# EasyEDA schematic microbit-v2-smart-robot-schematic-diagram.json
TITLE: microbit-v2-smart-robot; REV: 1.0; Date: 2023-03-23; Sheet: 1/1; Drawn By: professor_zia; Company: CET
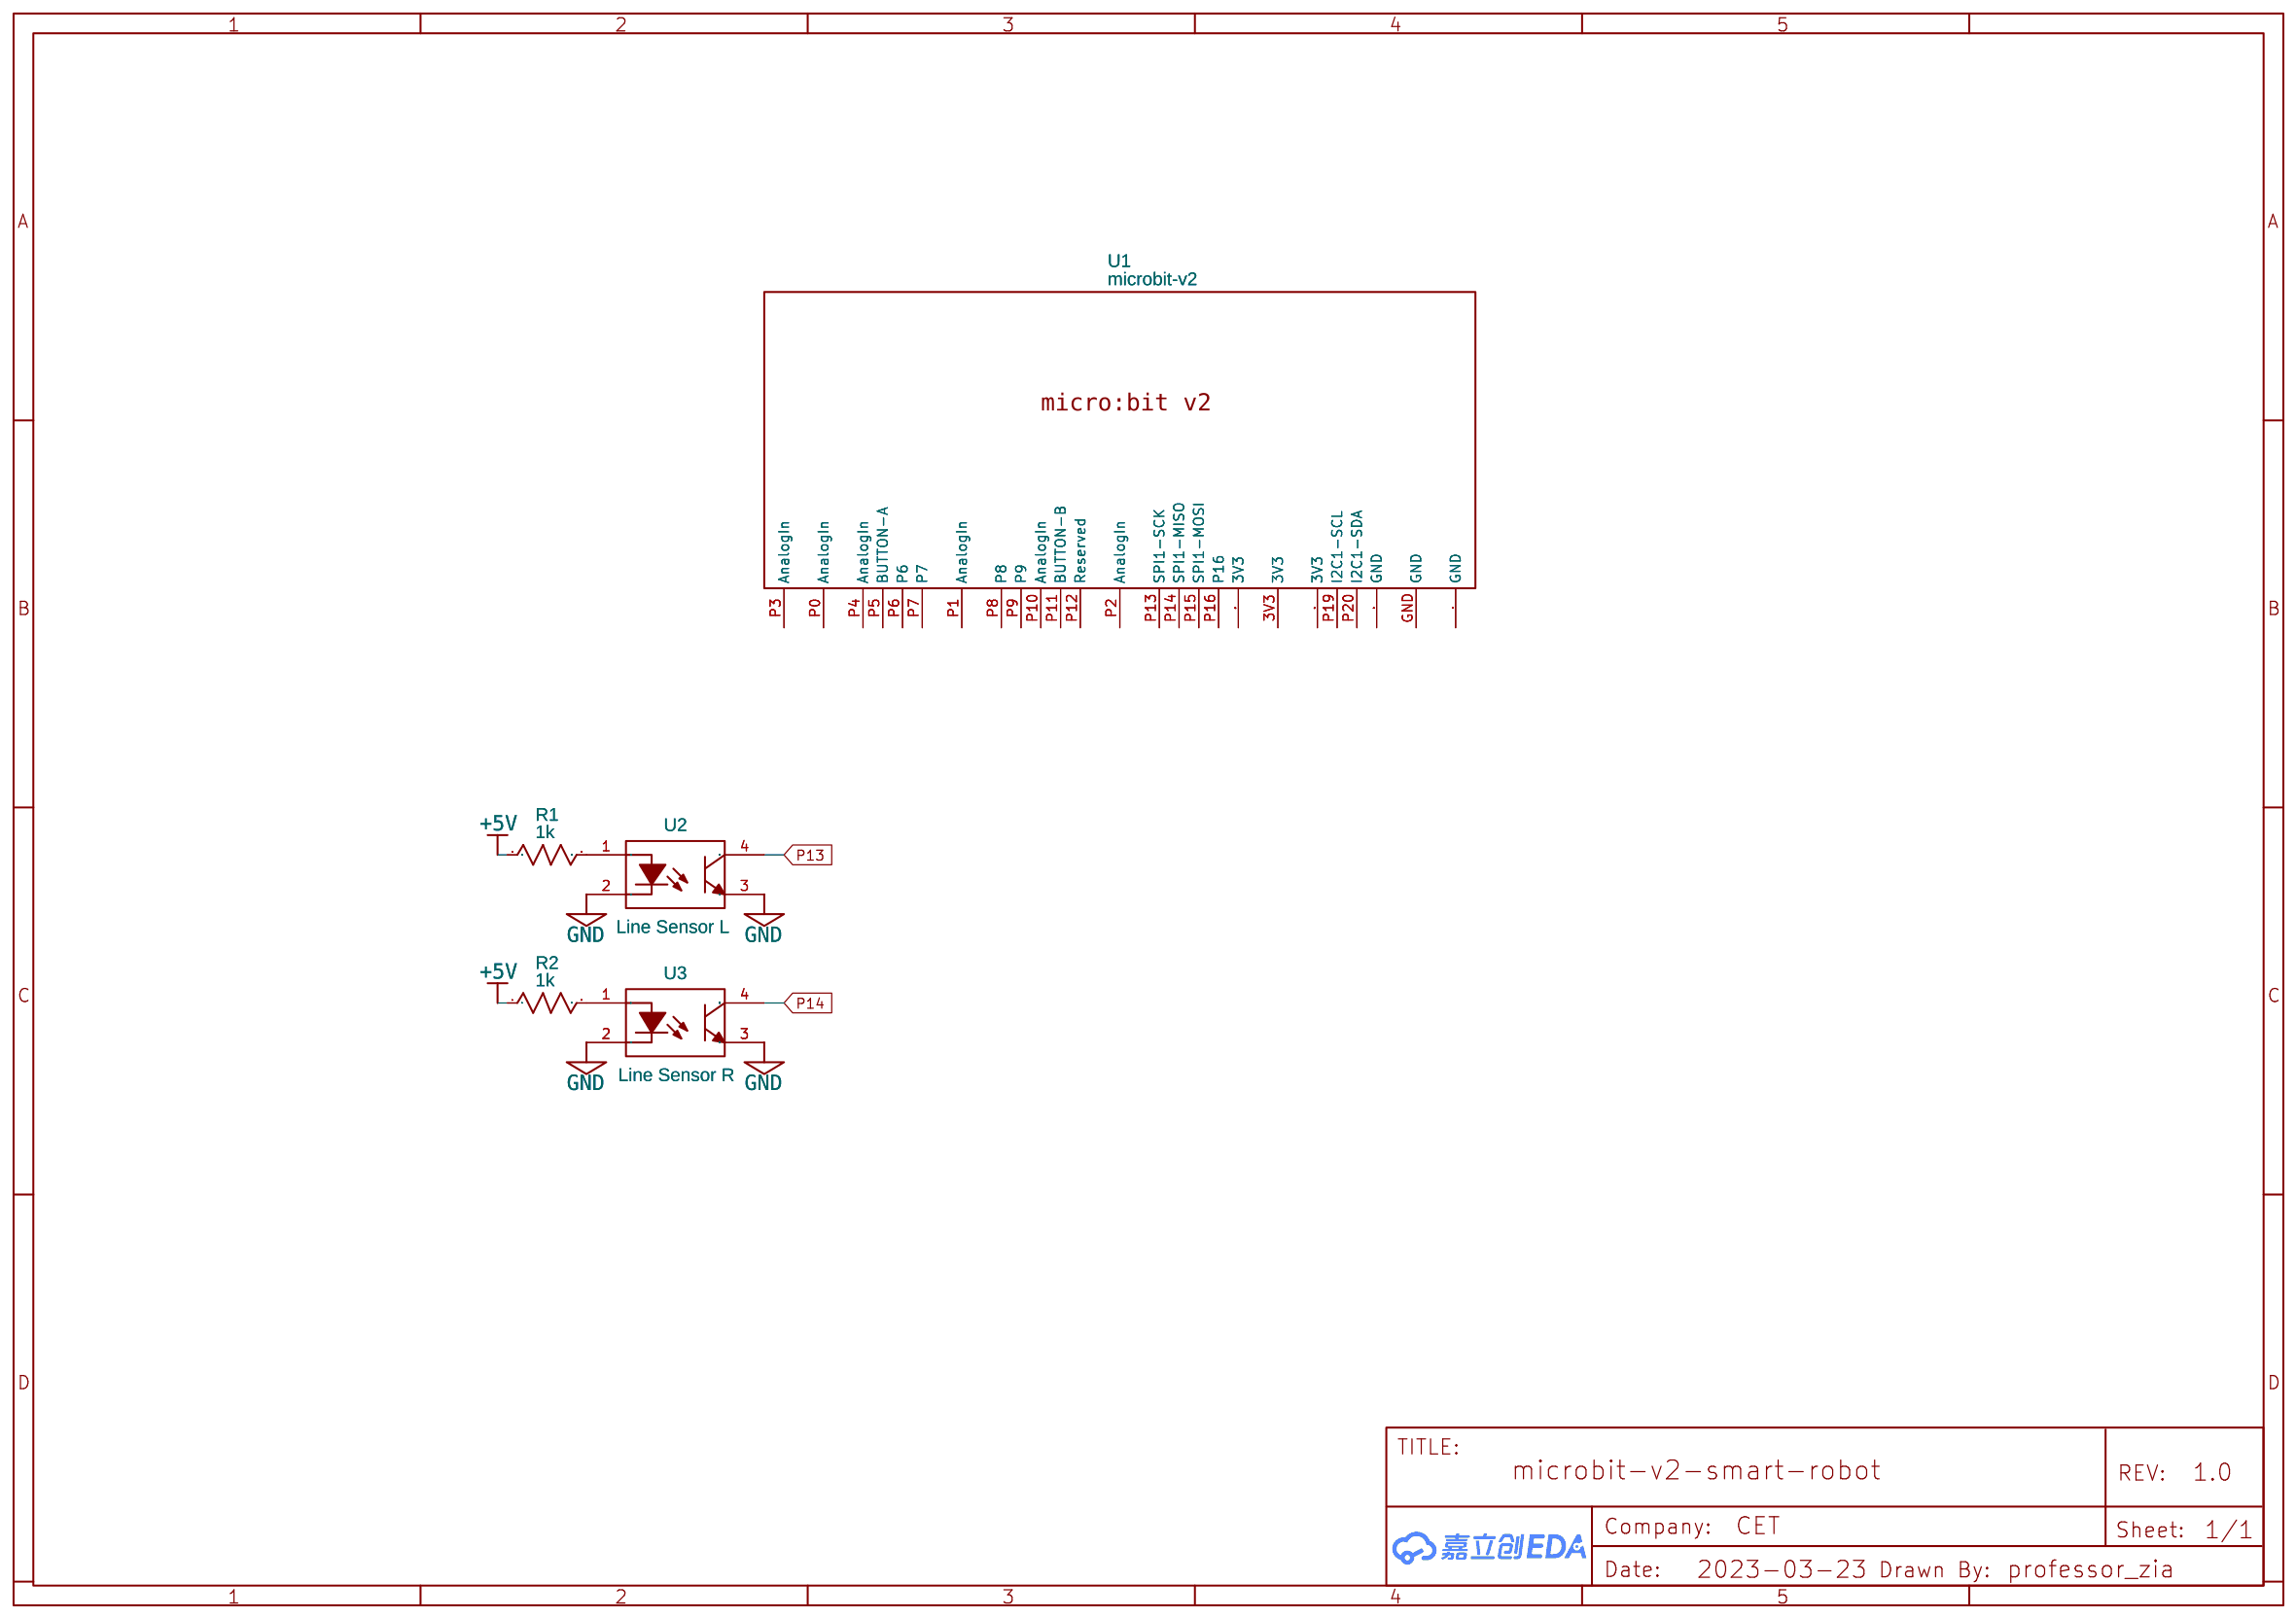
[diagram p0: schematic sheet]

## Parts
R1  1k  [R0603]
R2  1k  [R0603]
U1  microbit-v2
U2  Line Sensor L  [SOP-4_L4.4-W2.8-P1.27-LS7.0-BR]
U3  Line Sensor R  [SOP-4_L4.4-W2.8-P1.27-LS7.0-BR]

## Library data of the parts
R1 R2 = R_0603_US: Contributor: LCEDA_Lib
U1 = microbit-v2: Contributor: professor_zia
U2 U3 = TLP291(GB-TP,SE(O: Supplier: LCSC; Supplier Part: C393895; Manufacturer: TOSHIBA; Contributor: LCSC; JLCPCB Part Class: Extended Part

## Nets
+5V: R1.1 R2.1
GND: U2.2(CAT) U2.3(EM) U3.2(CAT) U3.3(EM)
P13: U2.4(COL)
P14: U3.4(COL)
Net-(R1-2): R1.2 U2.1(AN)
Net-(R2-2): R2.2 U3.1(AN)

Not connected (* = marked no-connect by the designer): U1 3V3 3Va(3V3) 3Vb(3V3) Ga(GND) Gb(GND) GND P0(AnalogIn) P1(AnalogIn) P2(AnalogIn) P3(AnalogIn) P4(AnalogIn) P5(BUTTON-A) P6 P7 P8 P9 P10(AnalogIn) P11(BUTTON-B) P12(Reserved) P13(SPI1-SCK) P14(SPI1-MISO) P15(SPI1-MOSI) P16 P19(I2C1-SCL) P20(I2C1-SDA)
